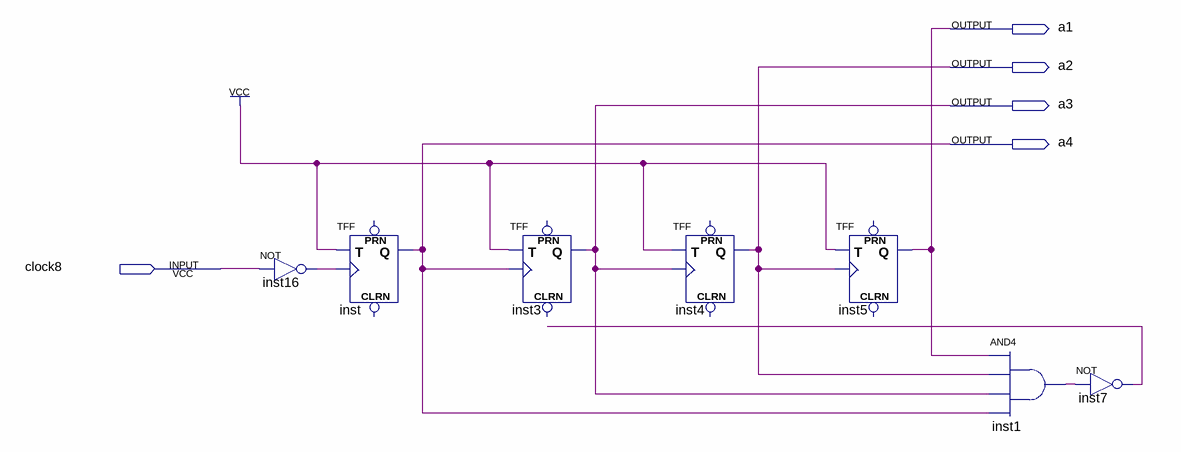
[diagram p0: schematic sheet]
// Quartus schematic descendingCounter1Digit.bdf as structural Verilog: 7 symbols, 5 pins
module descendingCounter1Digit (
  input  clock8,
  output a1,
  output a2,
  output a3,
  output a4
);

  wire inst1_out, inst7_out, inst16_out;

  not inst16 (inst16_out, clock8);
  TFF inst (.T(1'b1), .CLK(inst16_out), .Q(a4));  // open: PRN, CLRN
  TFF inst3 (.T(1'b1), .CLK(a4), .Q(a3));  // open: PRN, CLRN
  TFF inst4 (.T(1'b1), .CLK(a3), .Q(a2));  // open: PRN, CLRN
  TFF inst5 (.T(1'b1), .CLK(a2), .Q(a1));  // open: PRN, CLRN
  and inst1 (inst1_out, a1, a2, a3, a4);
  not inst7 (inst7_out, inst1_out);
endmodule
